# Altium schematic sheet Power.SchDoc
size A
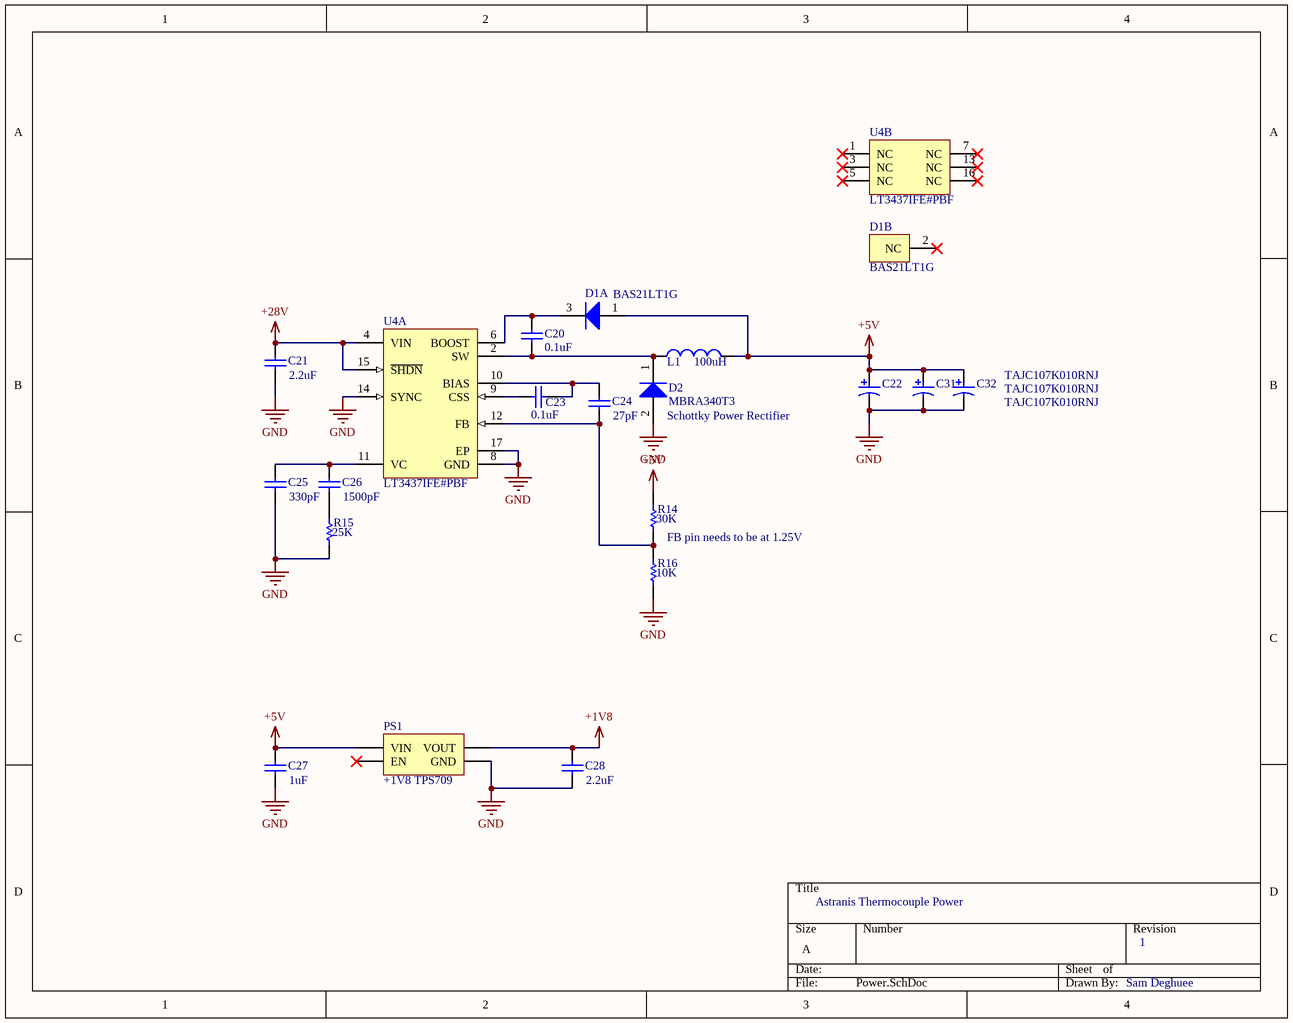
[diagram p0: Power.SchDoc]

## Parts
C20  value 0.1uF  [CAPC0603(1608)100_L]  (hidden comment: CAP0603)
C21  value 2.2uF  [CAPC0603(1608)100_L]  (hidden comment: CAP0603)
C22  TAJC107K010RNJ  [AVX-TAJ-C-2_M]
C23  value 0.1uF  [CAPC0603(1608)100_L]  (hidden comment: CAP0603)
C24  value 27pF  [CAPC0603(1608)100_L]  (hidden comment: CAP0603)
C25  value 330pF  [CAPC0603(1608)100_L]  (hidden comment: CAP0603)
C26  value 1500pF  [CAPC0603(1608)100_L]  (hidden comment: CAP0603)
C27  value 1uF  [CAPC0603(1608)100_L]  (hidden comment: CAP0603)
C28  value 2.2uF  [CAPC0603(1608)100_L]  (hidden comment: CAP0603)
C31  TAJC107K010RNJ  [AVX-TAJ-C-2_M]
C32  TAJC107K010RNJ  [AVX-TAJ-C-2_M]
D1  BAS21LT1G  [ONSC-SOT-23-3-318-08_V]  (parts A,B of 2)
D2  MBRA340T3  [ONSC-SMA-2-403D-02_F_V]
L1  Inductance: 100uH  [VISH-IHLP4040DZER101M11_V]  (hidden comment: IHLP4040DZER101M11)
PS1  +1V8 TPS709
R14  value 30K  [RESC0603(1608)_L]  (hidden comment: RES0603)
R15  value 25K  [RESC0603(1608)_L]  (hidden comment: RES0603)
R16  value 10K  [RESC0603(1608)_L]  (hidden comment: RES0603)
U4  LT3437IFE#PBF  [LT-FE-16-EPV-BC_M]  (parts A,B of 2)

## Nets
+1V8: C28.2 PS1.?2(VOUT)
+5V: C22.1 C27.2 C31.1 C32.1 D1.1(A) L1.2 PS1.?1(VIN) R14.2
+28V: C21.2 U4.4(VIN) U4.15(~{SHDN})
GND: C21.1 C22.2 C25.1 C27.1 C28.1 C31.2 C32.2 D2.2(A) PS1.?3(GND) R15.1 R16.1 U4.8(GND) U4.14(SYNC) U4.17(EP)
NetC20_1: C20.1 D1.3(K) U4.6(BOOST)
NetC20_2: C20.2 D2.1(K) L1.1 U4.2(SW)
NetC23_1: C23.1 C24.2 U4.10(BIAS)
NetC23_2: C23.2 U4.9(CSS)
NetC24_1: C24.1 R14.1 R16.2 U4.12(FB)
NetC25_2: C25.2 C26.2 U4.11(VC)
NetC26_1: C26.1 R15.2

Not connected (* = marked no-connect by the designer): D1 2(NC)*; PS1 ?4(EN)*; U4 1(NC)* 3(NC)* 5(NC)* 7(NC)* 13(NC)* 16(NC)*

## Notes on the sheet
- (near D2) Schottky Power Rectifier
- FB pin needs to be at 1.25V
- Astranis Thermocouple Power
- 1
- Sam Deghuee

## Library data of the parts
C20 C21 C23-C28 = CMP-1590-00005-1: 0603 (1608 Metric) Chip Capacitor; Case-Metric: 1608; Case-EIA: 0603; PackageReference: CAPC0603(1608)100
C22 C31 C32 = CMP-2100-03690-1: Standard Tantalum, 100 uF, +/- 10%, 10 V, -55 to 125 degC, 2-Pin SMD (2312), RoHS, Tape and Reel; Manufacturer: AVX; Capacitance: 100uF; Voltage Rating: 10V; ESR (Equivalent Series Resistance): 1.2Ohm; Polarity: Polar; Dissipation Factor: 8%; Leakage Current: 10uA; Height - Seated (Max): 0.11inch; Termination: SMD/SMT; RoHSCompliant: True; Length: 6mm; Max Operating Temperature: 125degC; Number of Pins: 2; Datasheet Version: 42401.0; Radiation Hardening: No; Package Description: 2-Pin Surface Mount Device, Body 6 x 3.25 mm; Case/Package: Molded; Datasheet URL: http://datasheets.avx.com/TAJ.pdf; Case Code (Metric): 6032; Manufacturer URL: http://www.avx.com/; Package Quantity: 1; Package Reference: TAJ-C-2; Width: 3.2mm; Packaging: TapeandReel; Depth: 3.2mm; Case Code (Imperial): 2412; REACH SVHC: NoSVHC; Height: 2.6mm; Dielectric Material: Tantalum; Voltage Rating (DC): 10V; Tolerance: 10%; Voltage: 10V; Lead Free: LeadFree; Min Operating Temperature: -55degC
D1 = CMP-1679-00004-3: DIODE SWITCH 200MA 250V SOT23; Manufacturer: ON Semiconductor; ComponentLink1Description: Datasheet; PackageReference: SOT-23-3-318-08; ComponentLink1URL: http://www.onsemi.com/pub_link/Collateral/BAS19LT1-D.PDF; PartNumber: BAS21LT1G; PartId: 1
D2 = CMP-1055-00314-1: Schottky Power Rectifier, 2-Pin SMA, Tape and Reel; Manufacturer: On Semiconductor; IFSM Max (A): 100; Configuration: Single; Mounting Technology: Surface Mount; PackageDescription: 2-Pin Small Molded Package, J-Bend Lead, Body 2.605 x 4.315 mm; PackageReference: SMA-2-403D-02_F; ComponentLink1URL: http://www.onsemi.com/; ComponentLink3Description: Package Specification; DatasheetVersion: Rev. 6; ComponentLink3URL: http://www.onsemi.com/pub_link/Collateral/1SMA5913BT3-D.PDF; ComponentLink2URL: http://www.onsemi.cn/pub_link/Collateral/MBRA340T3-D.PDF; PackageVersion: Rev. F, 11/2008; RoHS: FALSE; Packing: Tape and Reel; PartNumber: MBRA340T3; ComponentLink2Description: Datasheet; ComponentLink1Description: Manufacturer URL
L1 = CMP-2000-06447-1: Low Profile, High Current IHLP(R) Inductor, 100 uH, +/- 20%, 2.5 A, -55 to 125 degC, 2-Pin SMD, RoHS, Tape and Reel; Manufacturer: Vishay; Qualification: AEC-Q200; Test Frequency: 100kHz; Maximum DC Resistance: 270mOhms; Type: LowProfileHighCurrentIHLPInductor; Unit Weight: 0.070548oz; Shielding: Shielded; Brand: Vishay/Dale; Maximum DC Current: 2.25A; Termination Style: SMD/SMT; Mounting Style: SMD/SMT; Tolerance: 20%; Factory Pack Quantity: 500; Product Category: FixedInductors; Mounting Technology: SurfaceMount; Manufacturer URL: http://www.vishay.com/; Operating Temperature Range: -55Cto+125C; Datasheet Version: 08/2015; Product: PowerInductors; Packaging: Reel; Length: 10.3mm; Package Description: 2-Pin Surface Mount Device, Body 10.3 x 10.3 mm; Height: 4mm; Width: 10.3mm; Series: IHLP-4040DZ-11; RoHS: True; Package Reference: IHLP4040DZER101M11; Tradename: IHLP; Datasheet URL: http://www.vishay.com/docs/34192/lp40dz11.pdf; Package / Case: 4040
PS1 = TPS709: 150mA linear regulators, low dropout with reverse current protection; ComponentLink1Description: Datasheet; ComponentLink1URL: http://www.ti.com/lit/ds/symlink/tps709.pdf
R14-R16 = CMP-1591-00001-1: 0603 (1608 Metric) Chip Resistor; Case-Metric: 1608; Case-EIA: 0603; PackageReference: RESC0603(1608)
U4 = CMP-0491-00587-1: High Voltage 500 mA, 200 kHz Step-Down Switching Regulator with 100 uA Quiescent Current, 16-pin SOP (FE-16), -40 to 125 degC, Pb-Free; Manufacturer: Linear Technology; Over Voltage Protection(V): 80; Number of Outputs: 1; Frequency Sync Range: 240kHz - 700kHz; PackageReference: FE-16; ComponentLink2Description: Datasheet; ComponentLink1Description: Manufacturer URL; ComponentLink1URL: http://www.linear.com/; ComponentLink3URL: http://cds.linear.com/docs/en/packaging/05081663__J_FE16(BC).pdf; Mounting Technology: Surface Mount; PackageVersion: Rev. J, 11/2012; PartNumber: LT3437IFE#PBF; DatasheetVersion: Rev. C; RoHS: TRUE; ComponentLink3Description: Package Specification; ComponentLink2URL: http://cds.linear.com/docs/en/datasheet/3437fc.pdf; PackageDescription: 16-Pin Plastic TSSOP, Body 5 x 4.4 mm, Pitch 0.65 mm; PartId: 1